# EAGLE board ESP32-POV (EAGLE 6.5.0), part 1 of 6
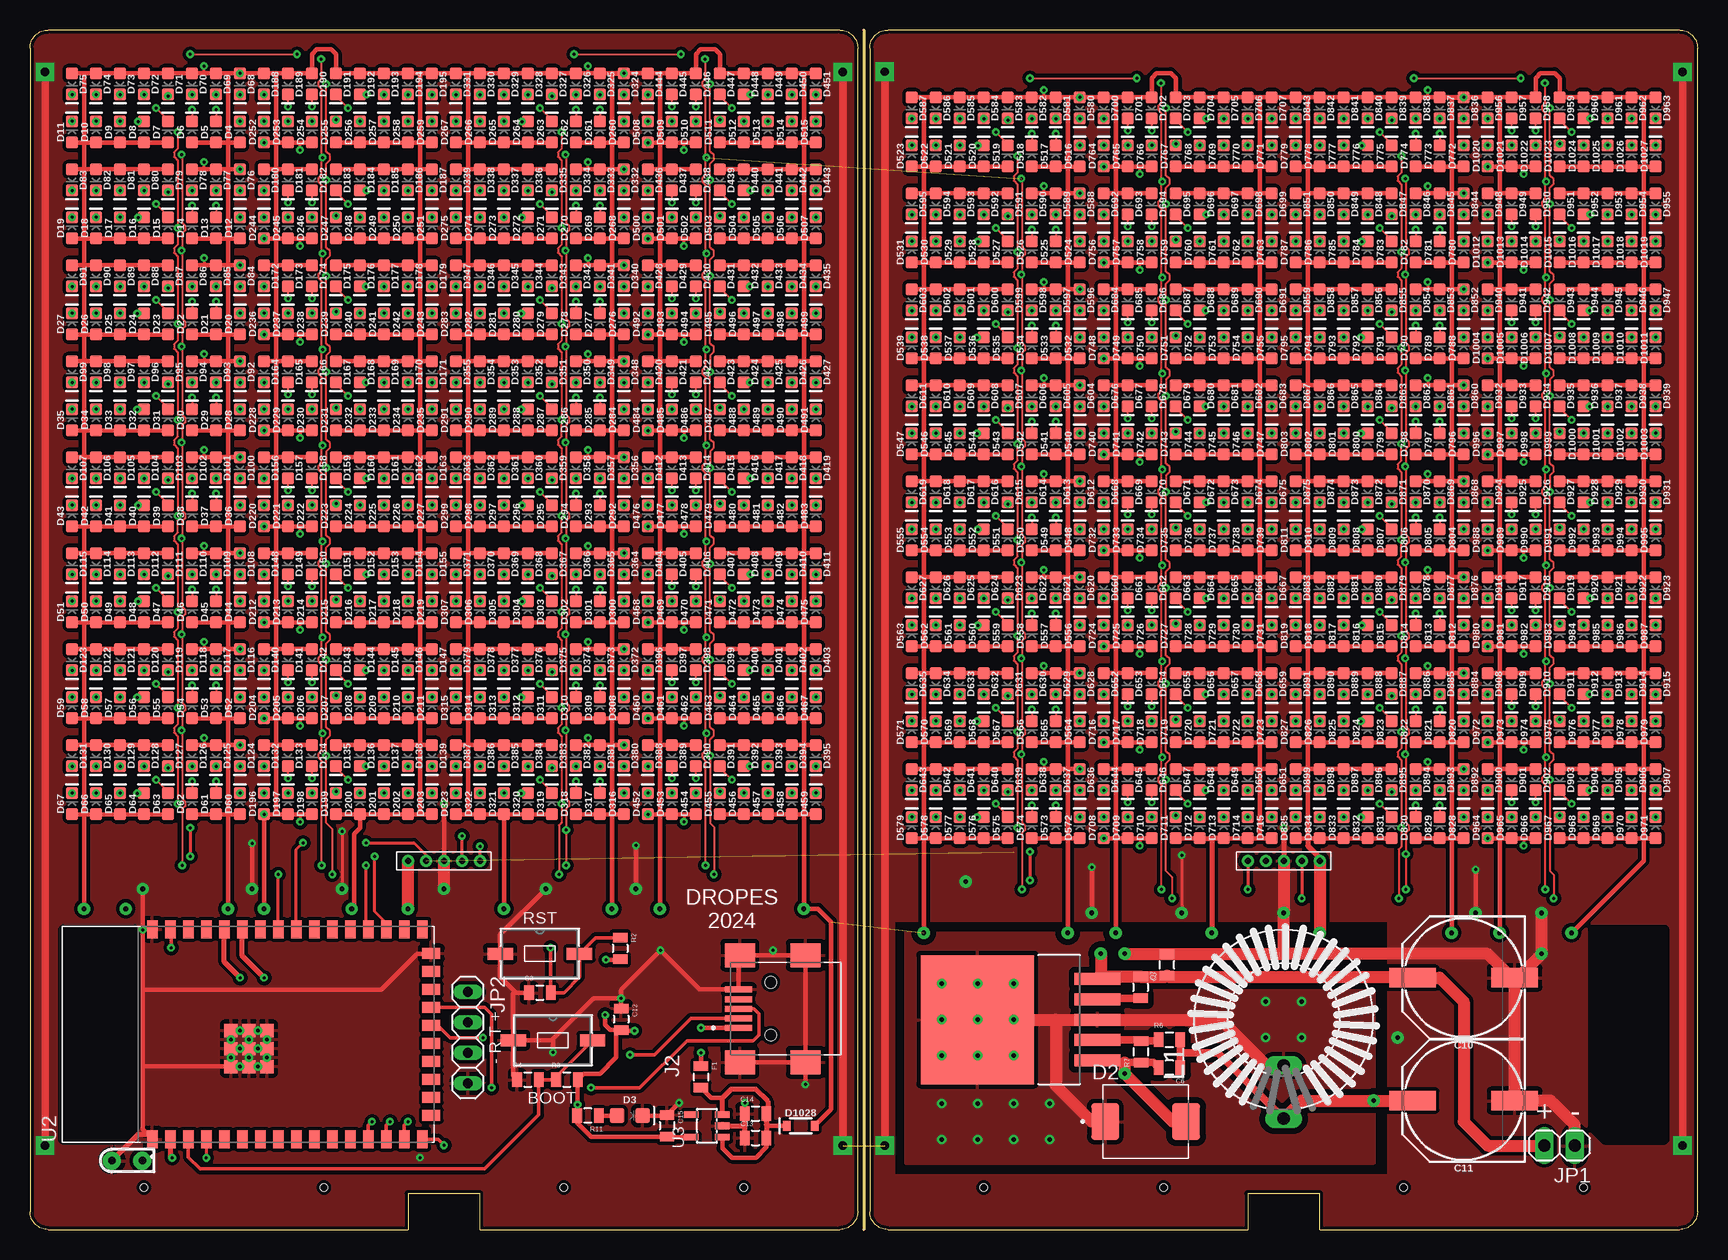
[diagram p9: board, top side]
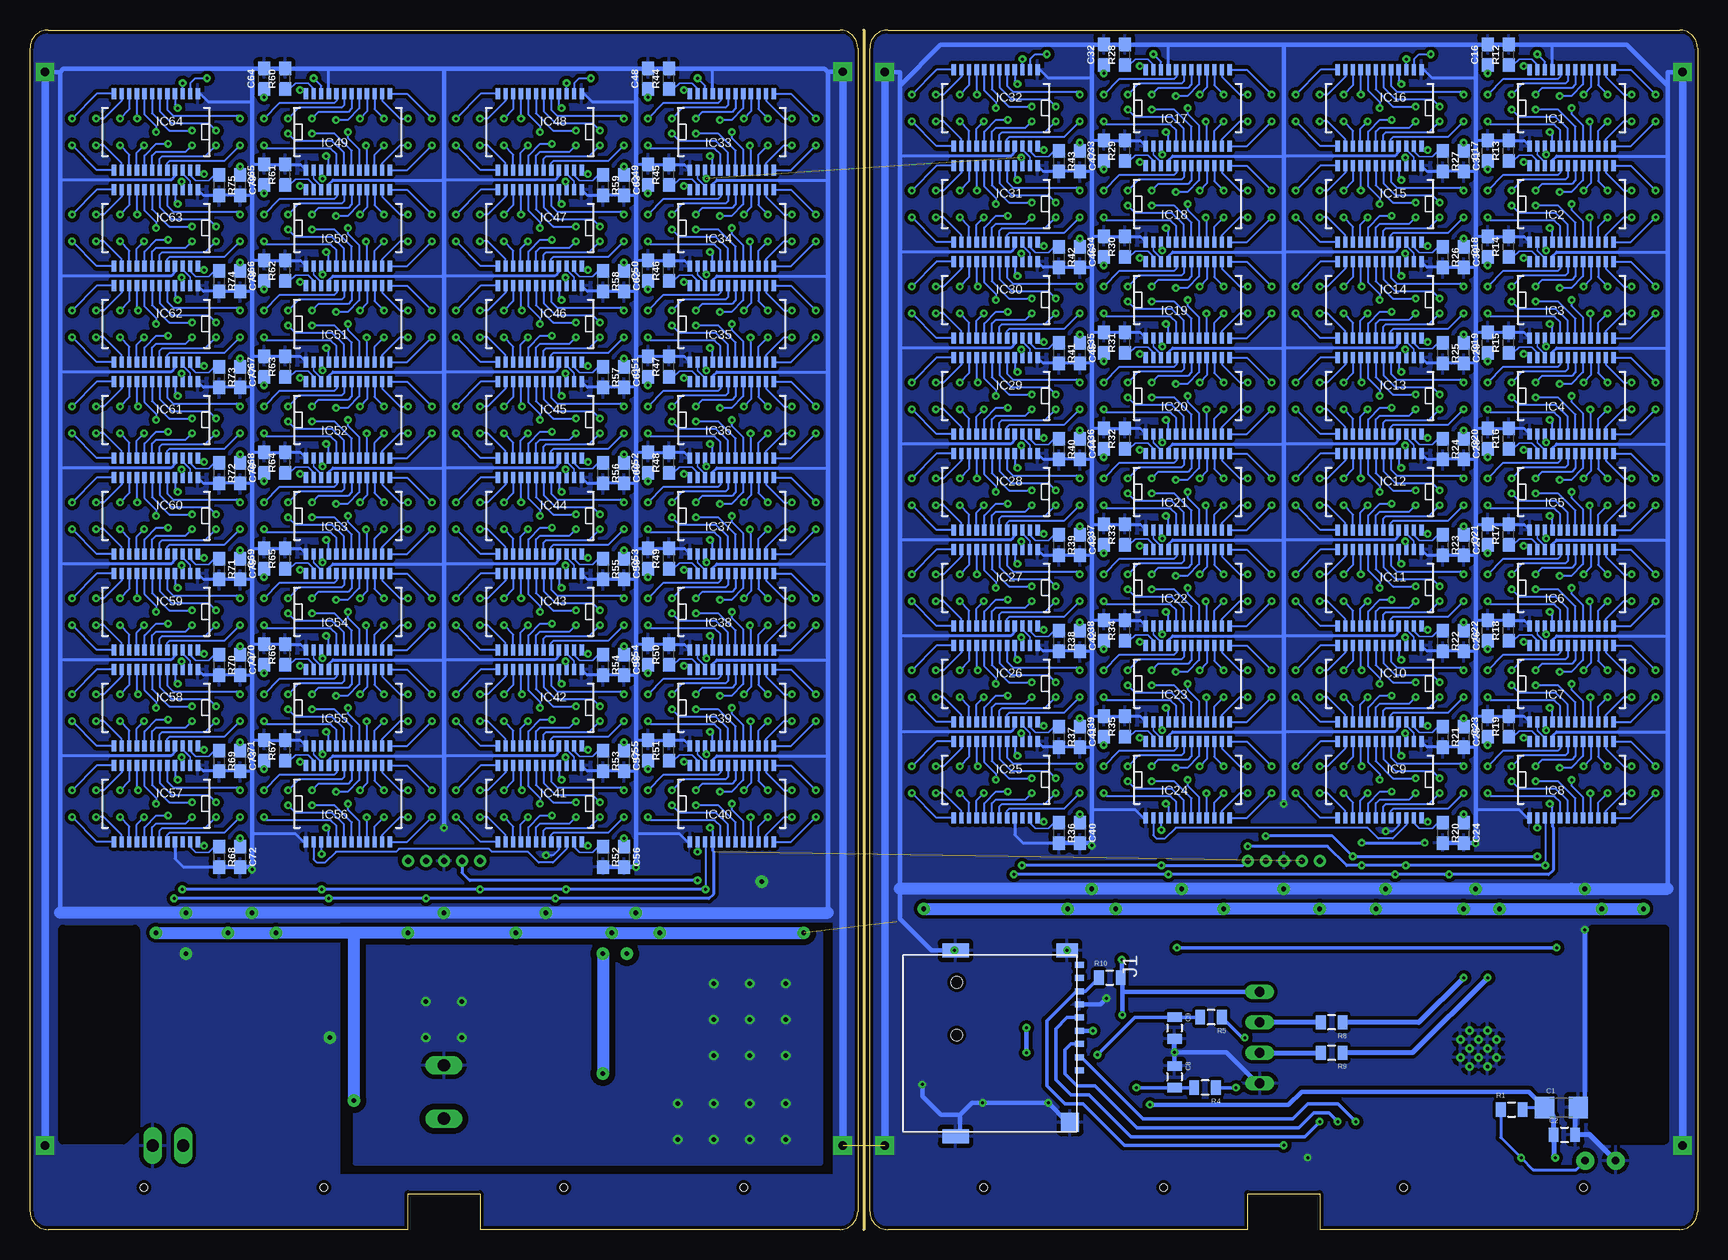
[diagram p10: board, bottom side, seen from below]

Size 139 x 100 mm. Coordinates in mm from the lower left corner, seen from the top.
Outline: 0,98.5 0,1.5 arc90 1.5,0 31.5,0 31.5,3 37.5,3 37.5,0 67.5,0 arc90 69,1.5 69,98.5 arc90 67.5,100 1.5,100 arc90 0,98.5
Outline: 70,98.5 70,1.5 arc90 71.5,0 101.5,0 101.5,3 107.5,3 107.5,0 137.5,0 arc90 139,1.5 139,98.5 arc90 137.5,100 71.5,100 arc90 70,98.5
Copper layers (1*16): Top 0.035mm / dielectric 1.5mm / Bottom 0.035mm
Design rules "POV3": minimum track width 5mil, minimum drill 0.25mm, track to track 5mil, track to pad 5mil, pad to pad 5mil, via to via 5mil, smd to smd 0mil, copper to edge 8mil, drill to drill 8mil, minimum pad ring 0.2mm, minimum via ring 0.2mm, stop-mask expansion 4mil, vias tented up to drill 25mil, thermal gap 15mil
Net classes: 0 default: width 0.127 mm; 2 3V3: width 0.127 mm; 3 5V: width 0.127 mm; 4 GND: width 0.127 mm; 5 +5V: width 0.127 mm
Holes 0.6 mm at 9.5,3.5 59.5,3.5 24.5,3.5 44.5,3.5 79.5,3.5 129.5,3.5 94.5,3.5 114.5,3.5
tRestrict: area 2.8,7.5 to 8.8,25; area 130.2,7.5 to 136.2,25
bRestrict: area 2.8,7.5 to 8.8,25; area 130.2,7.5 to 136.2,25
Milling: 1 lines

## Footprints (pad centres in the part's own frame; a part is rotated, then mirrored left to right if it is on the bottom)
1206 = smd 1.6 x 1.8: 1 -1.4,0; 2 1.4,0
0805 = smd 0.8 x 1.2: 1 -0.9,0; 2 0.9,0
PANASONIC_G = smd 3.9 x 1.6: + 4.25,0; - -4.25,0
0603 = smd 1.1 x 1: 1 -0.85,0; 2 0.85,0
LED_IR_REC = drill 0.6 pad 1.5: A -1.27,0; K 1.27,0
DIOM6959X245N = smd 2.33 x 3.07: A 3.365,0; C -3.365,0
LED-0805 = smd 1.2 x 1.2: A -1.05,0; C 1.05,0
LED-0603 = smd 1 x 1: A -0.877,0; C 0.877,0
SOD-323 = smd 0.63 x 0.83: A 1.15,0; C -1.15,0
DBQ24_TEX = smd 0.356 x 0.914: 1 -3.493,-3.175; 2 -2.857,-3.175; 3 -2.223,-3.175; 4 -1.587,-3.175; 5 -0.953,-3.175; 6 -0.318,-3.175; 7 0.318,-3.175; 8 0.953,-3.175; 9 1.587,-3.175; 10 2.223,-3.175; 11 2.857,-3.175; 12 3.493,-3.175; 13 3.493,3.175; 14 2.857,3.175; 15 2.223,3.175; 16 1.587,3.175; 17 0.953,3.175; 18 0.318,3.175; 19 -0.318,3.175; 20 -0.953,3.175; 21 -1.587,3.175; 22 -2.223,3.175; 23 -2.857,3.175; 24 -3.493,3.175
MICROSD-PUSH-OUT = smd 0.5 x 0.75: 1 9.625,0.225; 2 8.525,0.225; 3 7.425,0.225; 4 6.325,0.225; 5 5.225,0.225; 6 4.125,0.225; 7 3.025,0.225; 8 1.925,0.225; CD 0.825,0.225 | smd 1.2 x 1.8: G1 -0.375,-0.8 | smd 1.2 x 2.2: G2 -0.375,-10.1; G4 15.125,-10.1 | smd 1.6 x 1.5: G3 13.95,-0.55
AMPHENOL_10033527-N3112MLF = smd 0.5 x 2.25: 1 -1.6,2.675; 2 -0.8,2.675; 3 0,2.675; 4 0.8,2.675; 5 1.6,2.675 | smd 2 x 2.5: SH1 -4.45,2.58; SH2 4.45,2.58; SH3 -4.45,-2.87; SH4 4.45,-2.87 | hole 0.95: -2.2,0; 2.2,0
1X02 = drill 1.016 long: 1 -1.27,0; 2 1.27,0
PINHEAD_1X04 = drill 0.8 long: 1 -3.81,0; 2 -1.27,0; 3 1.27,0; 4 3.81,0
ED16 = drill 1.016 long: 1 -8.255,0; 2 -3.81,0
HEADER5 = drill 0.5 pad 1: 1 -3,0; 2 -1.5,0; 3 0,0; 4 1.5,0; 5 3,0
SW2_PTS636_SM25F_SMTR_LFS_CNK = smd 2.108 x 1: 1 -3.301,0; 2 3.301,0
MODULE_ESP32-S2-WROVER = smd 1.5 x 0.9: 1 -8.75,8; 2 -8.75,6.5; 3 -8.75,5; 4 -8.75,3.5; 5 -8.75,2; 6 -8.75,0.5; 7 -8.75,-1; 8 -8.75,-2.5; 9 -8.75,-4; 10 -8.75,-5.5; 11 -8.75,-7; 12 -8.75,-8.5; 13 -8.75,-10; 14 -8.75,-11.5; 15 -8.75,-13; 16 -8.75,-14.5; 27 8.75,-14.5; 28 8.75,-13; 29 8.75,-11.5; 30 8.75,-10; 31 8.75,-8.5; 32 8.75,-7; 33 8.75,-5.5; 34 8.75,-4; 35 8.75,-2.5; 36 8.75,-1; 37 8.75,0.5; 38 8.75,2; 39 8.75,3.5; 40 8.75,5; 41 8.75,6.5; 42 8.75,8 | smd 0.9 x 1.5: 17 -6.75,-15.25; 18 -5.25,-15.25; 19 -3.75,-15.25; 20 -2.25,-15.25; 21 -0.75,-15.25; 22 0.75,-15.25; 23 2.25,-15.25; 24 3.75,-15.25; 25 5.25,-15.25; 26 6.75,-15.25 | smd 1.1 x 1.1: 43_1 -2.69,1.45; 43_2 -1.19,1.45; 43_3 0.31,1.45; 43_4 -2.69,-0.05; 43_5 -1.19,-0.05; 43_6 0.31,-0.05; 43_7 -2.69,-1.55; 43_8 -1.19,-1.55; 43_9 0.31,-1.55 | drill 0.3 pad 0.406: 43_10 -1.94,1.45; 43_11 -0.44,1.45; 43_12 -2.69,0.7; 43_13 -1.19,0.7; 43_14 0.31,0.7; 43_15 -1.94,-0.05; 43_16 -0.44,-0.05; 43_17 -2.69,-0.8; 43_18 -1.19,-0.8; 43_19 0.31,-0.8; 43_20 -1.94,-1.55; 43_21 -0.44,-1.55
SOT23-5 = smd 0.55 x 1.2: 1 -0.95,-1.3; 2 0,-1.3; 3 0.95,-1.3; 4 0.95,1.3; 5 -0.95,1.3
TO263-5L_DIO = smd 1 x 3.8: 1 -3.4,-6.412; 2 -1.7,-6.412; 3 0,-6.412; 4 1.7,-6.412; 5 3.4,-6.412 | smd 10.75 x 9.45: 6 0,3.587